# Altium schematic sheet PLD_Connectors_PC-104.SchDoc: Connectors - PC-104
size A4; ApprovedBy: Piotr Kuligowski; CheckedBy: Piotr Kuligowski; Author: Michał Gumiela; SheetNumber: 2; SheetTotal: 13
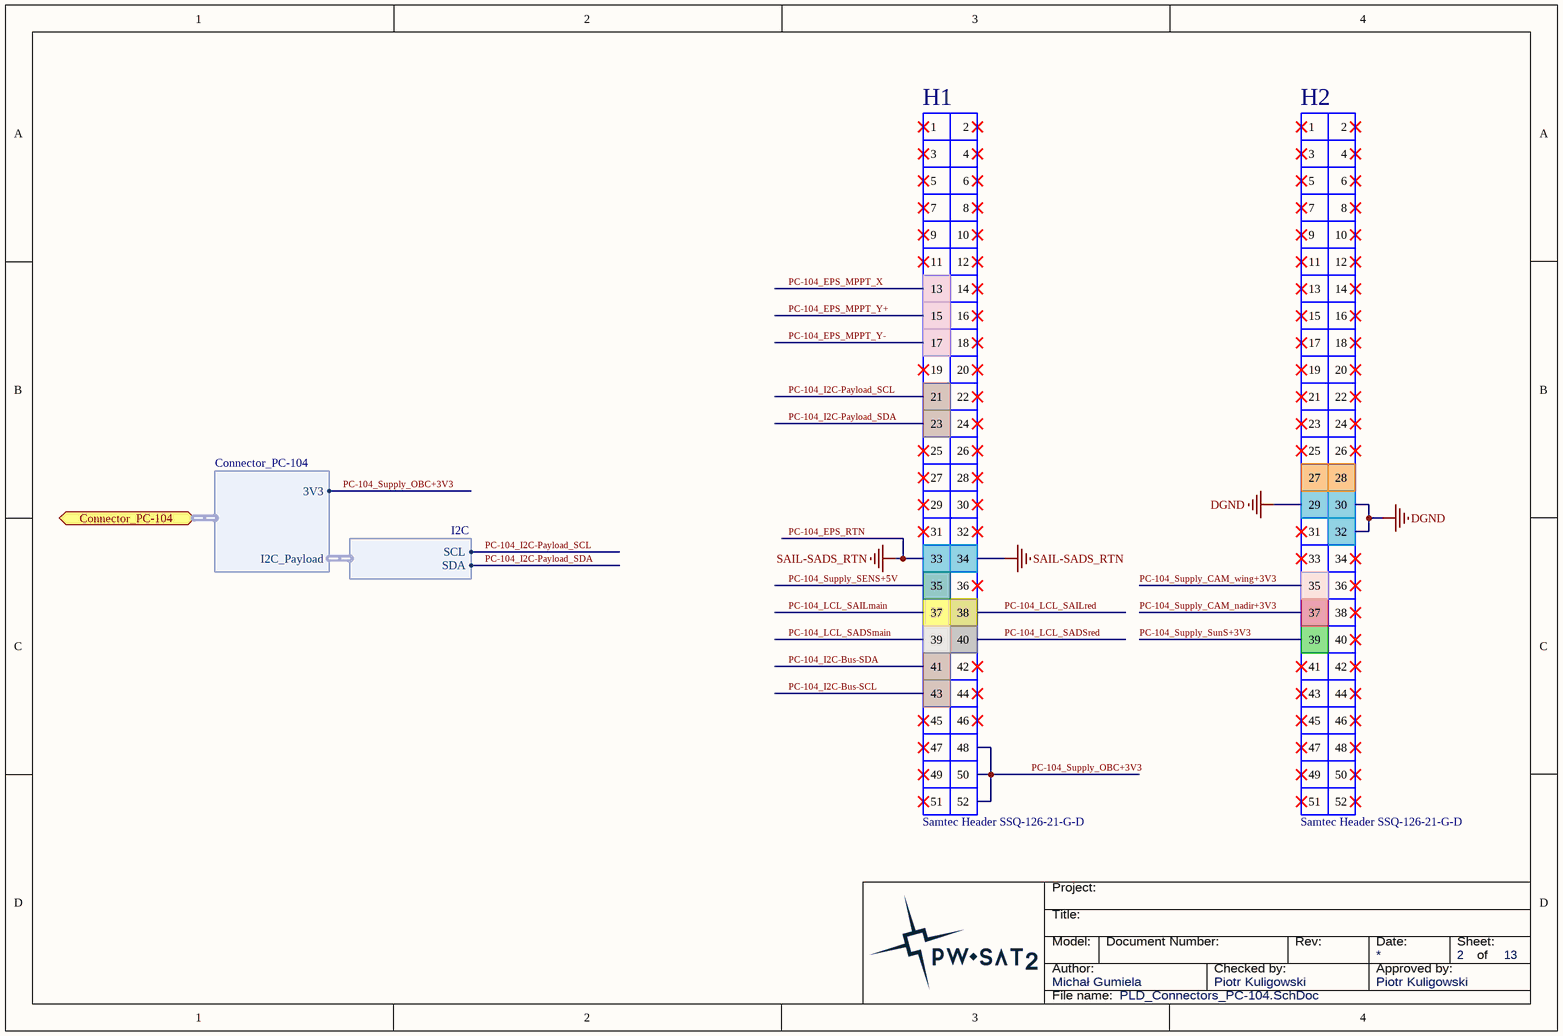
[diagram p0: PLD_Connectors_PC-104.SchDoc]

## Parts
H1  Samtec Header SSQ-126-21-G-D  [Samtec_SSQ-126-21-G-D]
H2  Samtec Header SSQ-126-21-G-D  [Samtec_SSQ-126-21-G-D]

## Ports
Connector_PC-104 (harness Connector_PC-104)

## Harnesses
I2C: SDA, SCL
Connector_PC-104: I2C_Payload, 3V3

## Nets
DGND: H2.29 H2.30 H2.32
PC-104_EPS_RTN: H1.33 H1.34  [also labelled SAIL-SADS_RTN]
PC-104_EPS_MPPT_X: H1.13
PC-104_EPS_MPPT_Y+: H1.15
PC-104_EPS_MPPT_Y-: H1.17
PC-104_I2C-Bus-SCL: H1.43
PC-104_I2C-Bus-SDA: H1.41
PC-104_I2C-Payload_SCL: H1.21 ; harness I2C.SCL
PC-104_I2C-Payload_SDA: H1.23 ; harness I2C.SDA
PC-104_LCL_SADSmain: H1.39
PC-104_LCL_SADSred: H1.40
PC-104_LCL_SAILmain: H1.37
PC-104_LCL_SAILred: H1.38
PC-104_Supply_CAM_nadir+3V3: H2.37
PC-104_Supply_CAM_wing+3V3: H2.35
PC-104_Supply_OBC+3V3: H1.48 H1.50 H1.52 ; port Connector_PC-104.3V3
PC-104_Supply_SENS+5V: H1.35
PC-104_Supply_SunS+3V3: H2.39

Not connected (* = marked no-connect by the designer): H1 1* 2* 3* 4* 5* 6* 7* 8* 9* 10* 11* 12* 14* 16* 18* 19* 20* 22* 24* 25* 26* 27* 28* 29* 30* 31* 32* 36* 42* 44* 45* 46* 47* 49* 51*; H2 1* 2* 3* 4* 5* 6* 7* 8* 9* 10* 11* 12* 13* 14* 15* 16* 17* 18* 19* 20* 21* 22* 23* 24* 25* 26* 27 28 31* 33* 34* 36* 38* 40* 41* 42* 43* 44* 45* 46* 47* 48* 49* 50* 51* 52*

## Notes on the sheet
- Title:
- Project:
- Author:
- Model:
- Document Number:
- Checked by:
- Rev:
- Date:
- Approved by:
- Sheet:
- of
- File name:

## Library data of the parts
H1 H2 = Samtec_SSQ-126-xx-x-D: Samtec SSQ Series Header , 2.54mm pitch, 2x26pin. PC-104 Stack Connector.; HelpUrl: http://suddendocs.samtec.com/catalog_english/ssq_th.pdf; Value: Samtec Header SSQ-126-21-G-D